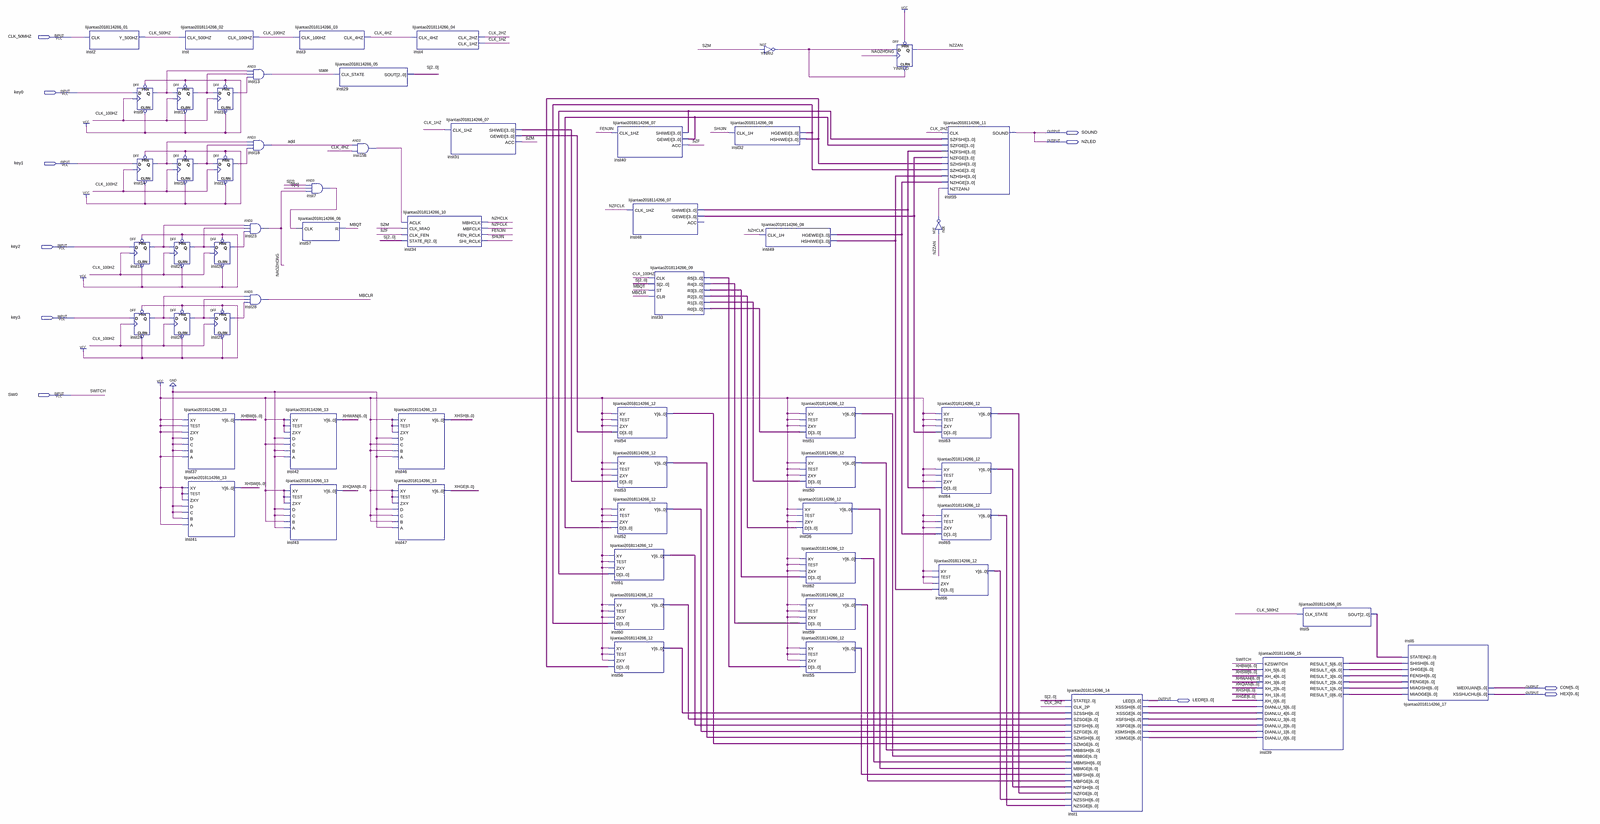
[diagram p0: schematic sheet, whole]
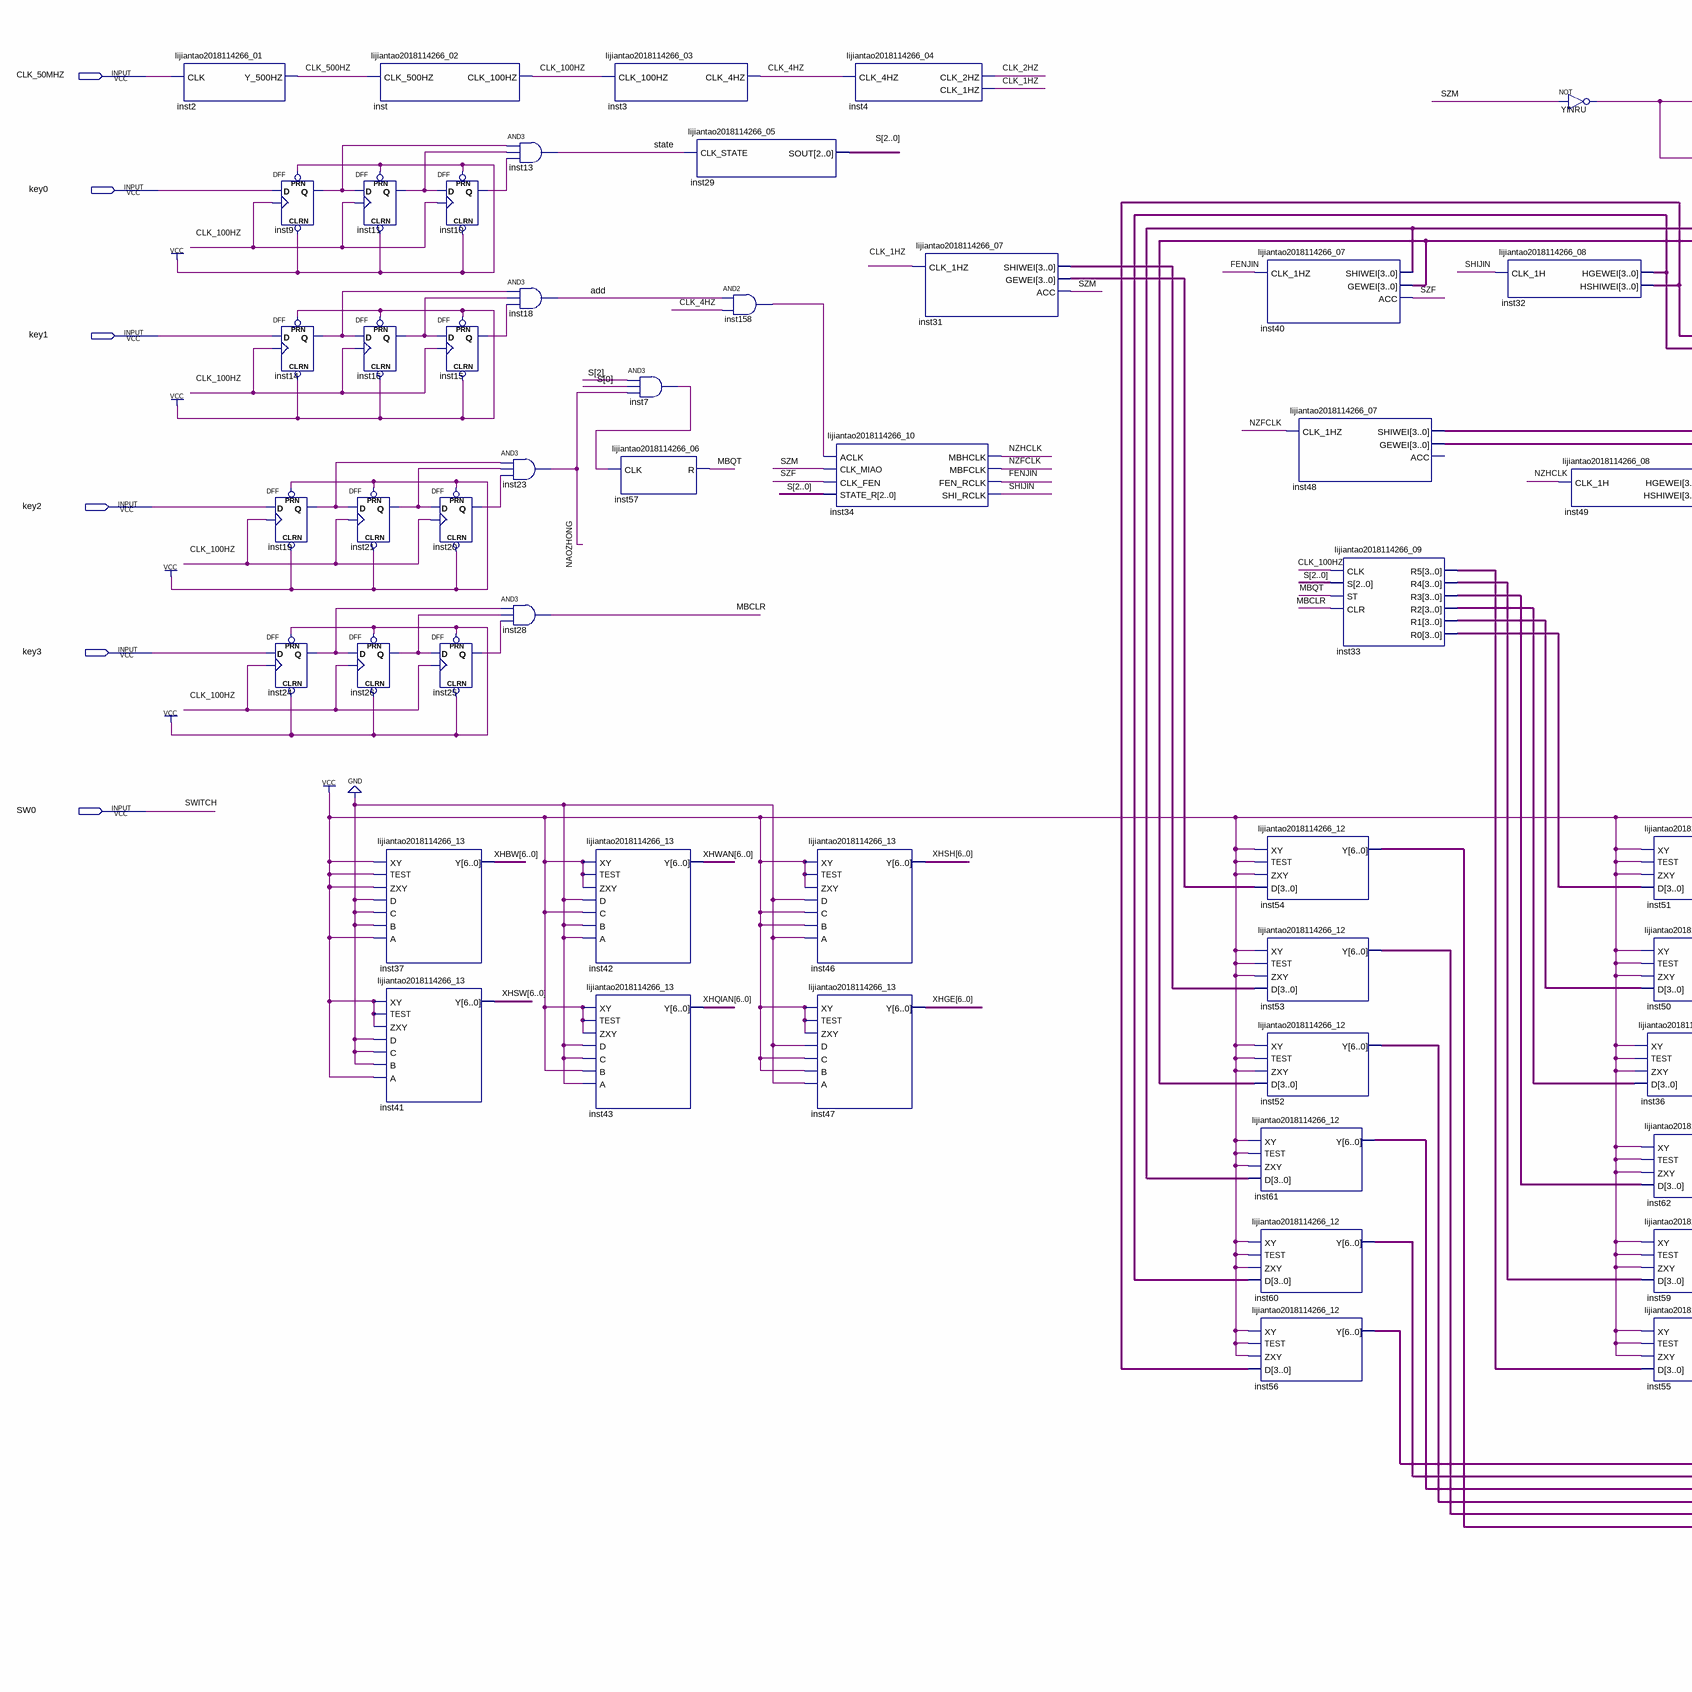
[diagram p1: schematic sheet, left part]
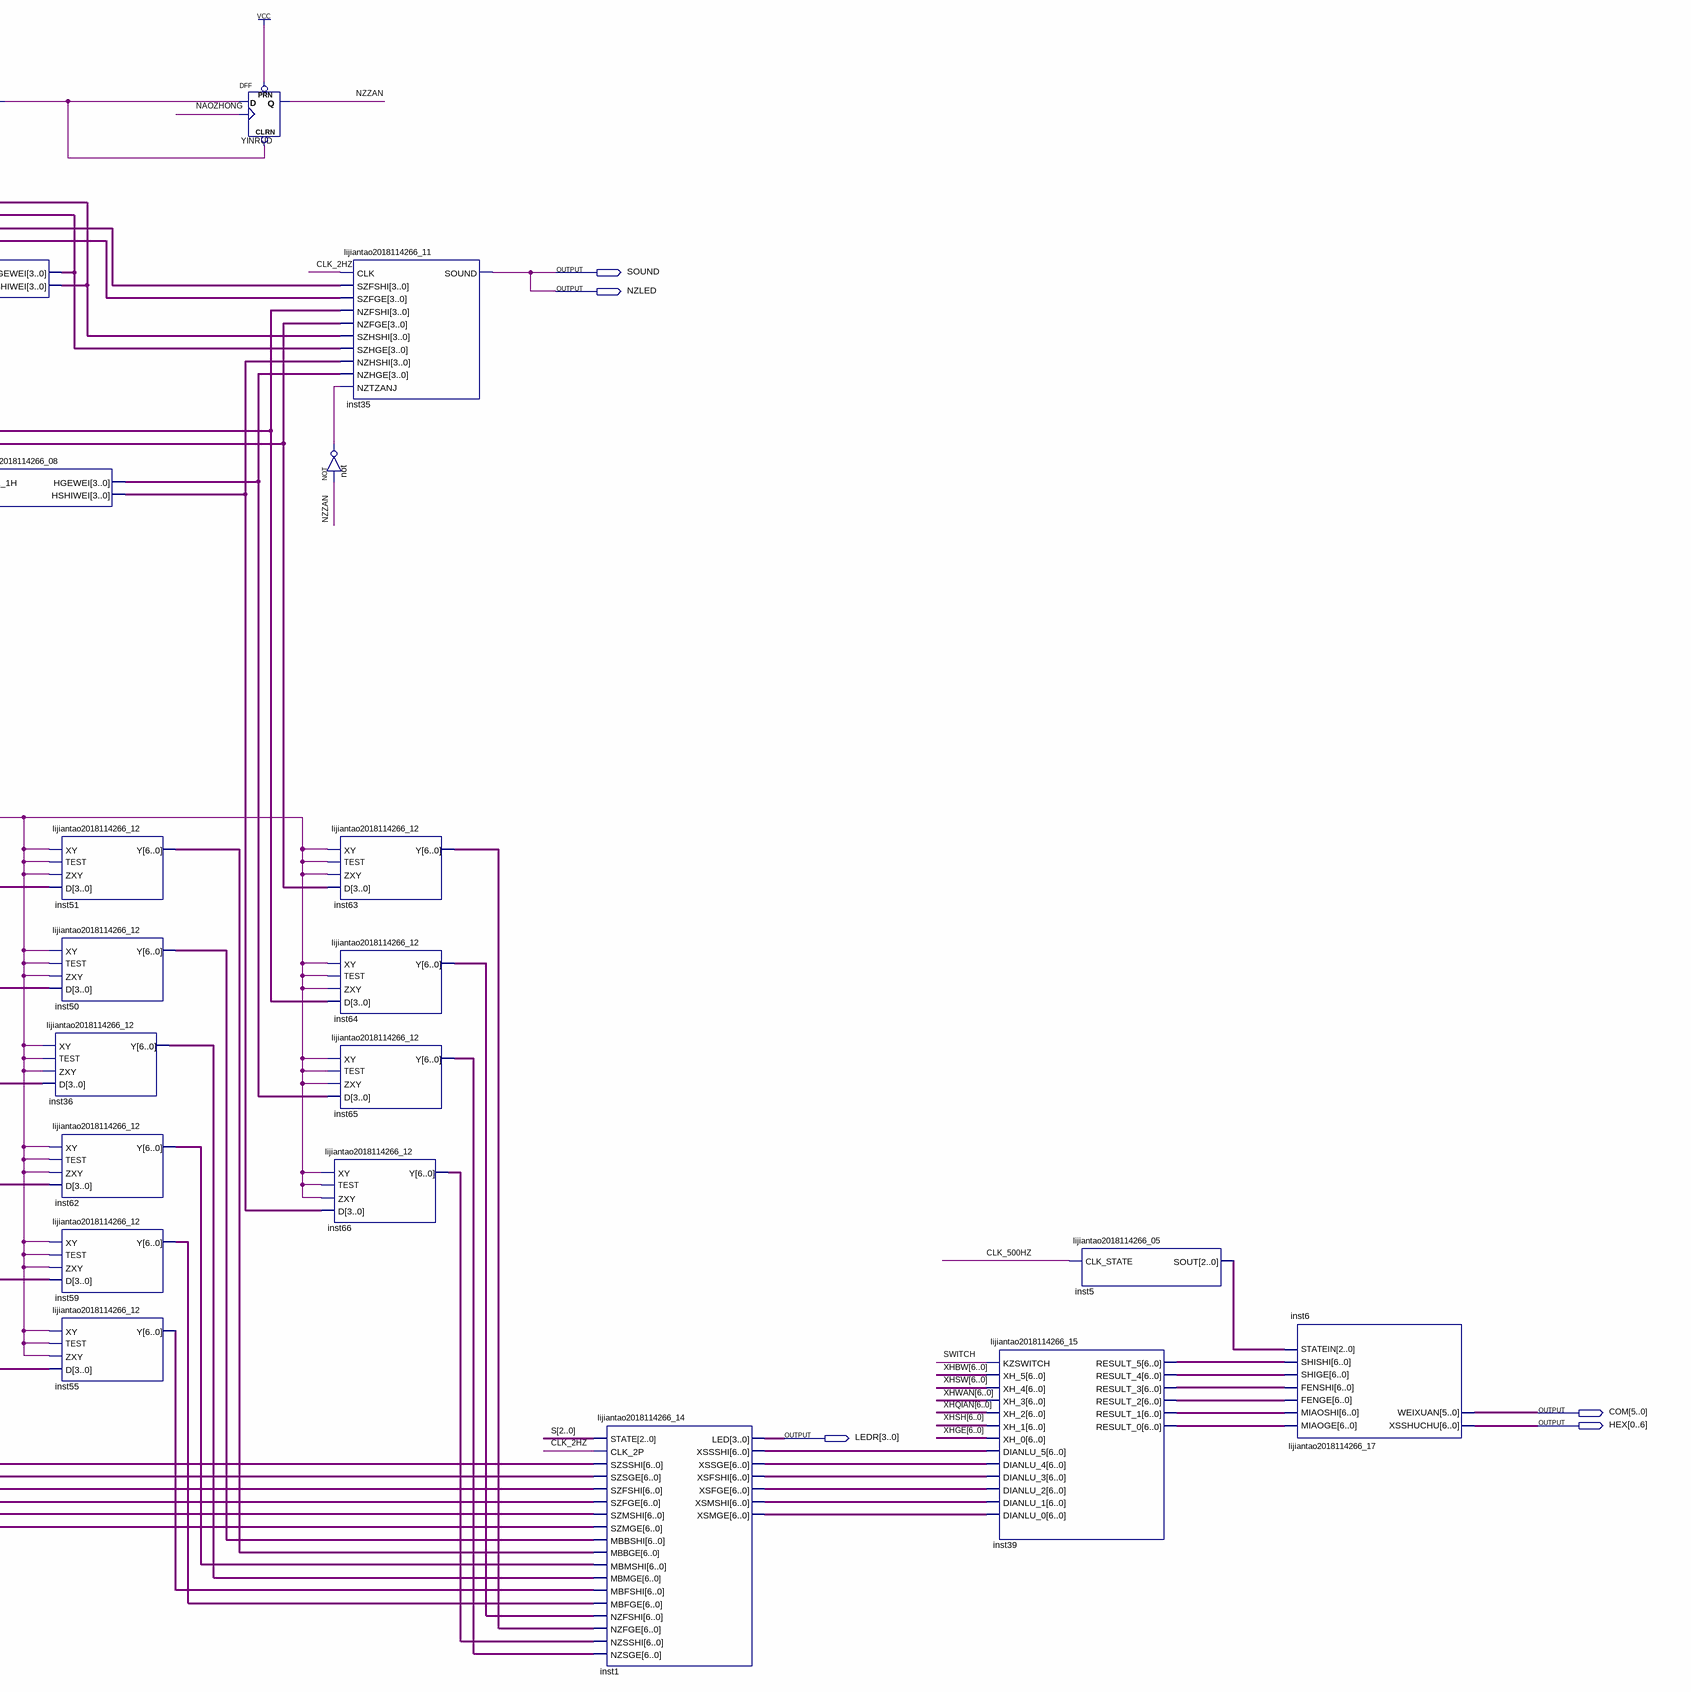
[diagram p2: schematic sheet, right part]
// Quartus schematic lijiantao2018114266_16.bdf as structural Verilog: 61 symbols, 11 pins
module lijiantao2018114266_16 (
  input  CLK_50MHZ,
  input  key0,
  input  key1,
  input  key2,
  input  key3,
  input  SW0,
  output SOUND,
  output NZLED,
  output [5:0] COM,
  output [0:6] HEX,
  output [3:0] LEDR
);

  wire add, CLK_1HZ, CLK_2HZ, CLK_4HZ, CLK_100HZ, CLK_500HZ, FENJIN, inst7_out, inst9_q, inst10_q, inst11_q,
       inst14_q, inst15_q, inst16_q, inst19_q, inst20_q, inst21_q, inst24_q, inst25_q, inst26_q, inst158_out,
       MBCLR, MBQT, NAOZHONG, not_out, NZFCLK, NZHCLK, NZZAN, SHIJIN, state, SZF, SZM, YINRU_out;
  wire [2:0] inst5_sout, S;
  wire [3:0] inst31_gewei, inst31_shiwei, inst32_hgewei, inst32_hshiwei, inst33_r0, inst33_r1, inst33_r2,
       inst33_r3, inst33_r4, inst33_r5, inst40_gewei, inst40_shiwei, inst48_gewei, inst48_shiwei,
       inst49_hgewei, inst49_hshiwei;
  wire [6:0] inst1_xsfge, inst1_xsfshi, inst1_xsmge, inst1_xsmshi, inst1_xssge, inst1_xssshi, inst36_y,
       inst39_result_0, inst39_result_1, inst39_result_2, inst39_result_3, inst39_result_4, inst39_result_5,
       inst50_y, inst51_y, inst52_y, inst53_y, inst54_y, inst55_y, inst56_y, inst59_y, inst60_y, inst61_y,
       inst62_y, inst63_y, inst64_y, inst65_y, inst66_y, XHBW, XHGE, XHQIAN, XHSH, XHSW, XHWAN;

  lijiantao2018114266_01 inst2 (.CLK(CLK_50MHZ), .Y_500HZ(CLK_500HZ));
  DFF inst9 (.CLRN(1'b1), .CLK(CLK_100HZ), .D(key0), .PRN(1'b1), .Q(inst9_q));
  DFF inst14 (.CLRN(1'b1), .CLK(CLK_100HZ), .D(key1), .PRN(1'b1), .Q(inst14_q));
  DFF inst19 (.CLRN(1'b1), .CLK(CLK_100HZ), .D(key2), .PRN(1'b1), .Q(inst19_q));
  DFF inst24 (.CLRN(1'b1), .CLK(CLK_100HZ), .D(key3), .PRN(1'b1), .Q(inst24_q));
  lijiantao2018114266_02 inst (.CLK_500HZ(CLK_500HZ), .CLK_100HZ(CLK_100HZ));
  DFF inst11 (.CLRN(1'b1), .CLK(CLK_100HZ), .D(inst9_q), .PRN(1'b1), .Q(inst11_q));
  DFF inst16 (.CLRN(1'b1), .CLK(CLK_100HZ), .D(inst14_q), .PRN(1'b1), .Q(inst16_q));
  DFF inst21 (.CLRN(1'b1), .CLK(CLK_100HZ), .D(inst19_q), .PRN(1'b1), .Q(inst21_q));
  DFF inst26 (.CLRN(1'b1), .CLK(CLK_100HZ), .D(inst24_q), .PRN(1'b1), .Q(inst26_q));
  lijiantao2018114266_13 inst37 (.XY(1'b1), .TEST(1'b1), .ZXY(1'b1), .D(1'b0), .C(1'b0), .B(1'b0), .A(1'b1), .Y(XHBW));
  lijiantao2018114266_13 inst41 (.XY(1'b1), .TEST(1'b1), .ZXY(1'b1), .D(1'b0), .C(1'b0), .B(1'b0), .A(1'b1), .Y(XHSW));
  DFF inst10 (.CLRN(1'b1), .CLK(CLK_100HZ), .D(inst11_q), .PRN(1'b1), .Q(inst10_q));
  DFF inst15 (.CLRN(1'b1), .CLK(CLK_100HZ), .D(inst16_q), .PRN(1'b1), .Q(inst15_q));
  DFF inst20 (.CLRN(1'b1), .CLK(CLK_100HZ), .D(inst21_q), .PRN(1'b1), .Q(inst20_q));
  DFF inst25 (.CLRN(1'b1), .CLK(CLK_100HZ), .D(inst26_q), .PRN(1'b1), .Q(inst25_q));
  and inst13 (state, inst9_q, inst11_q, inst10_q);
  and inst18 (add, inst14_q, inst16_q, inst15_q);
  and inst23 (NAOZHONG, inst19_q, inst21_q, inst20_q);
  and inst28 (MBCLR, inst24_q, inst26_q, inst25_q);
  lijiantao2018114266_03 inst3 (.CLK_100HZ(CLK_100HZ), .CLK_4HZ(CLK_4HZ));
  and inst7 (inst7_out, S[2], S[0], NAOZHONG);
  lijiantao2018114266_06 inst57 (.CLK(inst7_out), .R(MBQT));
  lijiantao2018114266_13 inst42 (.XY(1'b1), .TEST(1'b1), .ZXY(1'b1), .D(1'b0), .C(1'b1), .B(1'b0), .A(1'b0), .Y(XHWAN));
  lijiantao2018114266_13 inst43 (
    .XY(1'b1), .TEST(1'b1), .ZXY(1'b1), .D(1'b0), .C(1'b0), .B(1'b1), .A(1'b0), .Y(XHQIAN));
  lijiantao2018114266_05 inst29 (.CLK_STATE(state), .SOUT(S));
  and inst158 (inst158_out, add, CLK_4HZ);
  lijiantao2018114266_10 inst34 (
    .ACLK(inst158_out), .CLK_MIAO(SZM), .CLK_FEN(SZF), .STATE_R(S), .MBHCLK(NZHCLK), .MBFCLK(NZFCLK),
    .FEN_RCLK(FENJIN), .SHI_RCLK(SHIJIN));
  lijiantao2018114266_13 inst46 (.XY(1'b1), .TEST(1'b1), .ZXY(1'b1), .D(1'b0), .C(1'b1), .B(1'b1), .A(1'b0), .Y(XHSH));
  lijiantao2018114266_13 inst47 (.XY(1'b1), .TEST(1'b1), .ZXY(1'b1), .D(1'b0), .C(1'b1), .B(1'b1), .A(1'b0), .Y(XHGE));
  lijiantao2018114266_04 inst4 (.CLK_4HZ(CLK_4HZ), .CLK_2HZ(CLK_2HZ), .CLK_1HZ(CLK_1HZ));
  lijiantao2018114266_07 inst31 (.CLK_1HZ(CLK_1HZ), .SHIWEI(inst31_shiwei), .GEWEI(inst31_gewei), .ACC(SZM));
  lijiantao2018114266_07 inst40 (.CLK_1HZ(FENJIN), .SHIWEI(inst40_shiwei), .GEWEI(inst40_gewei), .ACC(SZF));
  lijiantao2018114266_07 inst48 (.CLK_1HZ(NZFCLK), .SHIWEI(inst48_shiwei), .GEWEI(inst48_gewei));  // open: ACC
  lijiantao2018114266_12 inst54 (.XY(1'b1), .TEST(1'b1), .ZXY(1'b1), .D(inst31_gewei), .Y(inst54_y));
  lijiantao2018114266_12 inst53 (.XY(1'b1), .TEST(1'b1), .ZXY(1'b1), .D(inst31_shiwei), .Y(inst53_y));
  lijiantao2018114266_12 inst52 (.XY(1'b1), .TEST(1'b1), .ZXY(1'b1), .D(inst40_gewei), .Y(inst52_y));
  lijiantao2018114266_12 inst61 (.XY(1'b1), .TEST(1'b1), .ZXY(1'b1), .D(inst40_shiwei), .Y(inst61_y));
  lijiantao2018114266_12 inst60 (.XY(1'b1), .TEST(1'b1), .ZXY(1'b1), .D(inst32_hgewei), .Y(inst60_y));
  lijiantao2018114266_12 inst56 (.XY(1'b1), .TEST(1'b1), .ZXY(1'b1), .D(inst32_hshiwei), .Y(inst56_y));
  lijiantao2018114266_09 inst33 (
    .CLK(CLK_100HZ), .S(S), .ST(MBQT), .CLR(MBCLR), .R5(inst33_r5), .R4(inst33_r4), .R3(inst33_r3),
    .R2(inst33_r2), .R1(inst33_r1), .R0(inst33_r0));
  lijiantao2018114266_08 inst32 (.CLK_1H(SHIJIN), .HGEWEI(inst32_hgewei), .HSHIWEI(inst32_hshiwei));
  not YINRU (YINRU_out, SZM);
  lijiantao2018114266_08 inst49 (.CLK_1H(NZHCLK), .HGEWEI(inst49_hgewei), .HSHIWEI(inst49_hshiwei));
  lijiantao2018114266_12 inst51 (.XY(1'b1), .TEST(1'b1), .ZXY(1'b1), .D(inst33_r0), .Y(inst51_y));
  lijiantao2018114266_12 inst50 (.XY(1'b1), .TEST(1'b1), .ZXY(1'b1), .D(inst33_r1), .Y(inst50_y));
  lijiantao2018114266_12 inst36 (.XY(1'b1), .TEST(1'b1), .ZXY(1'b1), .D(inst33_r2), .Y(inst36_y));
  lijiantao2018114266_12 inst62 (.XY(1'b1), .TEST(1'b1), .ZXY(1'b1), .D(inst33_r3), .Y(inst62_y));
  lijiantao2018114266_12 inst59 (.XY(1'b1), .TEST(1'b1), .ZXY(1'b1), .D(inst33_r4), .Y(inst59_y));
  lijiantao2018114266_12 inst55 (.XY(1'b1), .TEST(1'b1), .ZXY(1'b1), .D(inst33_r5), .Y(inst55_y));
  DFF YINRUD (.CLRN(YINRU_out), .CLK(NAOZHONG), .D(YINRU_out), .PRN(1'b1), .Q(NZZAN));
  lijiantao2018114266_11 inst35 (
    .CLK(CLK_2HZ), .SZFSHI(inst40_shiwei), .SZFGE(inst40_gewei), .NZFSHI(inst48_shiwei),
    .NZFGE(inst48_gewei), .SZHSHI(inst32_hshiwei), .SZHGE(inst32_hgewei), .NZHSHI(inst49_hshiwei),
    .NZHGE(inst49_hgewei), .NZTZANJ(not_out), .SOUND(NZLED));
  not \not  (not_out, NZZAN);
  lijiantao2018114266_12 inst63 (.XY(1'b1), .TEST(1'b1), .ZXY(1'b1), .D(inst48_gewei), .Y(inst63_y));
  lijiantao2018114266_12 inst64 (.XY(1'b1), .TEST(1'b1), .ZXY(1'b1), .D(inst48_shiwei), .Y(inst64_y));
  lijiantao2018114266_12 inst65 (.XY(1'b1), .TEST(1'b1), .ZXY(1'b1), .D(inst49_hgewei), .Y(inst65_y));
  lijiantao2018114266_12 inst66 (.XY(1'b1), .TEST(1'b1), .ZXY(1'b1), .D(inst49_hshiwei), .Y(inst66_y));
  lijiantao2018114266_14 inst1 (
    .STATE(S), .CLK_2P(CLK_2HZ), .SZSSHI(inst56_y), .SZSGE(inst60_y), .SZFSHI(inst61_y), .SZFGE(inst52_y),
    .SZMSHI(inst53_y), .SZMGE(inst54_y), .MBBSHI(inst50_y), .MBBGE(inst51_y), .MBMSHI(inst62_y),
    .MBMGE(inst36_y), .MBFSHI(inst55_y), .MBFGE(inst59_y), .NZFSHI(inst64_y), .NZFGE(inst63_y),
    .NZSSHI(inst66_y), .NZSGE(inst65_y), .LED(LEDR), .XSSSHI(inst1_xssshi), .XSSGE(inst1_xssge),
    .XSFSHI(inst1_xsfshi), .XSFGE(inst1_xsfge), .XSMSHI(inst1_xsmshi), .XSMGE(inst1_xsmge));
  lijiantao2018114266_15 inst39 (
    .KZSWITCH(SW0), .XH_5(XHBW), .XH_4(XHSW), .XH_3(XHWAN), .XH_2(XHQIAN), .XH_1(XHSH), .XH_0(XHGE),
    .DIANLU_5(inst1_xssshi), .DIANLU_4(inst1_xssge), .DIANLU_3(inst1_xsfshi), .DIANLU_2(inst1_xsfge),
    .DIANLU_1(inst1_xsmshi), .DIANLU_0(inst1_xsmge), .RESULT_5(inst39_result_5), .RESULT_4(inst39_result_4),
    .RESULT_3(inst39_result_3), .RESULT_2(inst39_result_2), .RESULT_1(inst39_result_1),
    .RESULT_0(inst39_result_0));
  lijiantao2018114266_05 inst5 (.CLK_STATE(CLK_500HZ), .SOUT(inst5_sout));
  lijiantao2018114266_17 inst6 (
    .MIAOGE(inst39_result_0), .MIAOSHI(inst39_result_1), .FENGE(inst39_result_2), .FENSHI(inst39_result_3),
    .SHIGE(inst39_result_4), .SHISHI(inst39_result_5), .STATEIN(inst5_sout), .XSSHUCHU(HEX), .WEIXUAN(COM));

  assign SOUND = NZLED;

  // Other names for the same wires on the sheet: SWITCH = SW0
endmodule
